# EAGLE design VIC-20_CHARSET_adapter (EAGLE 9.6.2)
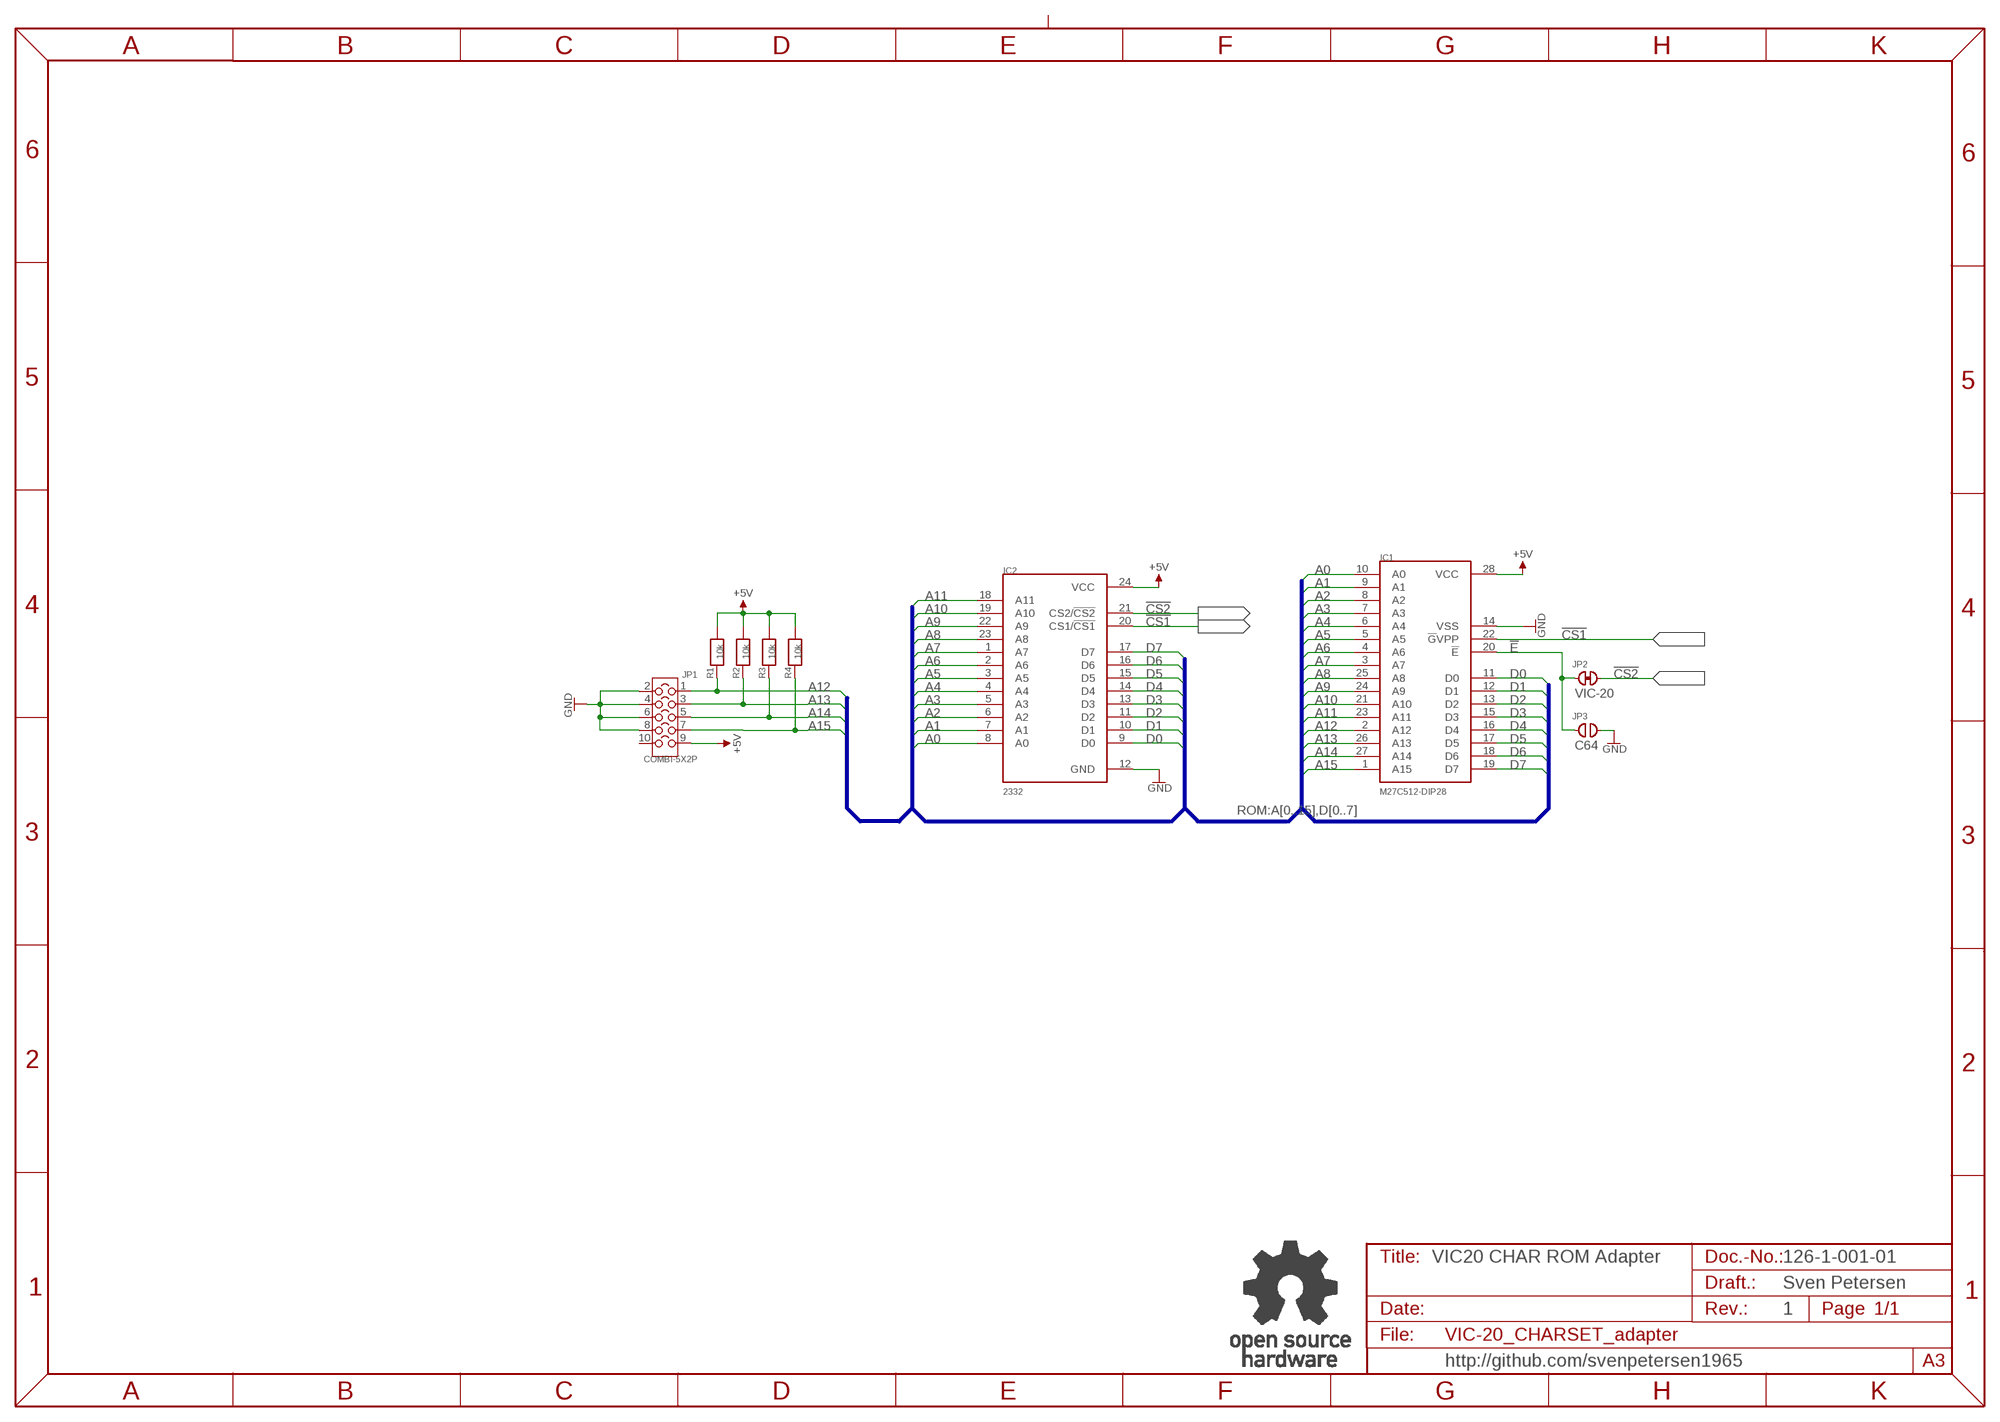
[diagram p0: schematic, sheet 1]

## Parts
IC1  M27C512-DIP28  [DIL28-6]
IC2  2332  [DIL24_SOCKET]
JP1  COMBI-5X2P  [COMBI-5X2]
JP2  CLOSED  [CP_CL]
JP3  OPEN  [CP_OP]
R1  10k  R-0805  [0805]
R2  10k  R-0805  [0805]
R3  10k  R-0805  [0805]
R4  10k  R-0805  [0805]
U$6  OPEN_SOURCE_HW  [OPENHW]

## Nets
!CS1: IC1.22(!G!VPP) IC2.20(CS1/!CS1)
!CS2: IC2.21(CS2/!CS2) JP2.2
!E: IC1.20(!E) JP2.1 JP3.1
+5V: IC1.28(VCC) IC2.24(VCC) JP1.9 R1.2 R2.2 R3.2 R4.2
A0: IC1.10(A0) IC2.8(A0)
A1: IC1.9(A1) IC2.7(A1)
A2: IC1.8(A2) IC2.6(A2)
A3: IC1.7(A3) IC2.5(A3)
A4: IC1.6(A4) IC2.4(A4)
A5: IC1.5(A5) IC2.3(A5)
A6: IC1.4(A6) IC2.2(A6)
A7: IC1.3(A7) IC2.1(A7)
A8: IC1.25(A8) IC2.23(A8)
A9: IC1.24(A9) IC2.22(A9)
A10: IC1.21(A10) IC2.19(A10)
A11: IC1.23(A11) IC2.18(A11)
A12: IC1.2(A12) JP1.1 R1.1
A13: IC1.26(A13) JP1.3 R2.1
A14: IC1.27(A14) JP1.5 R3.1
A15: IC1.1(A15) JP1.7 R4.1
D0: IC1.11(D0) IC2.9(D0)
D1: IC1.12(D1) IC2.10(D1)
D2: IC1.13(D2) IC2.11(D2)
D3: IC1.15(D3) IC2.13(D3)
D4: IC1.16(D4) IC2.14(D4)
D5: IC1.17(D5) IC2.15(D5)
D6: IC1.18(D6) IC2.16(D6)
D7: IC1.19(D7) IC2.17(D7)
GND: IC1.14(VSS) IC2.12(GND) JP1.2 JP1.4 JP1.6 JP1.8 JP3.2
Unconnected: JP1.10

## Buses
ROM:A[0..15],D[0..7]

## Notes on the sheet
- VIC-20
- C64
- VIC20 CHAR ROM Adapter | 126-1-001-01
- Sven Petersen
- 1
- http://github.com/svenpetersen1965

## Library data of the parts
IC1 = ST:M27C512
IC2 = MOS:2332
JP1 = Cutpad:COMBI-5X2P
JP2 = Cutpad:CLOSED: Closed Cutpad
JP3 = Cutpad:OPEN: open Cutpad
R1-R4 = SMD:R-0805
U$6 = Logo:OPEN_SOURCE_HW

## Board
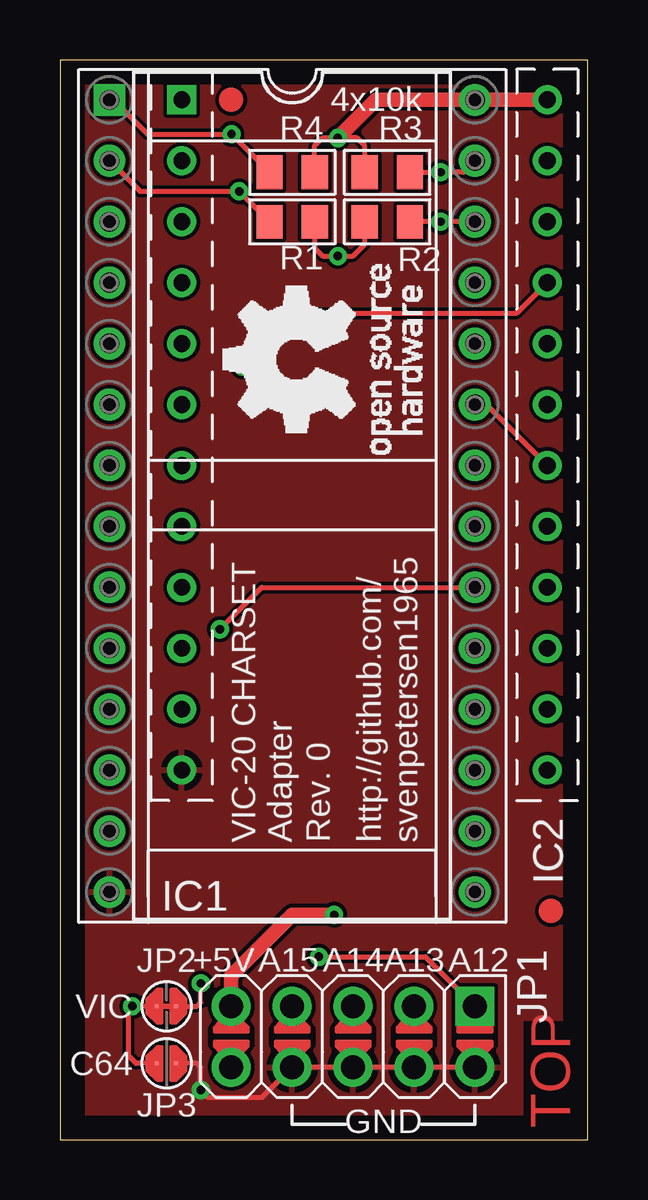
[diagram p1: board, top side]
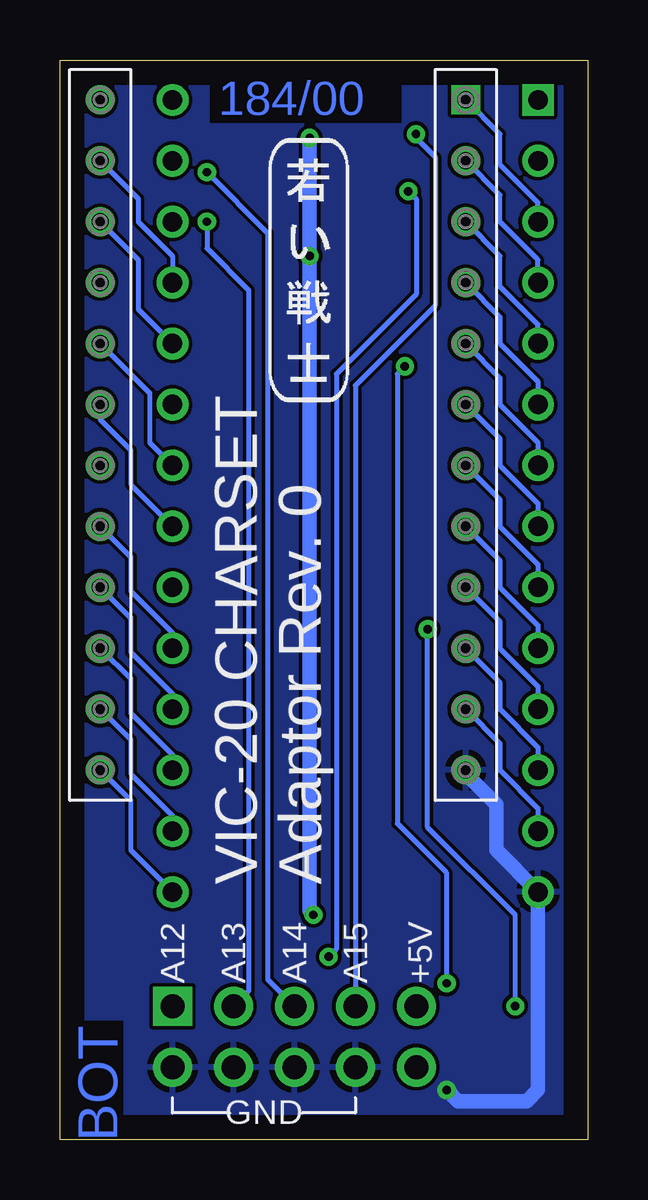
[diagram p2: board, bottom side, seen from below]

Size 22 x 45 mm. Coordinates in mm from the lower left corner, seen from the top.
Outline: 0,0 22,0 22,45 0,45 0,0
Copper layers (1*16): Top 0.035mm / dielectric 1.5mm / Bottom 0.035mm
Design rules "default *": minimum track width 6mil, minimum drill 0.35mm, track to track 6mil, track to pad 6mil, pad to pad 6mil, via to via 6mil, smd to smd 6mil, copper to edge 40mil, drill to drill 6mil, minimum pad ring 10mil, minimum via ring 8mil, stop-mask expansion 4mil, vias tented up to drill 24mil, thermal gap 10mil
bRestrict: 3 lines

### Footprints (pad centres in the part's own frame; a part is rotated, then mirrored left to right if it is on the bottom)
DIL28-6 = drill 0.813 square: 1 -16.51,-7.62 | drill 0.813: 2 -13.97,-7.62; 3 -11.43,-7.62; 4 -8.89,-7.62; 5 -6.35,-7.62; 6 -3.81,-7.62; 7 -1.27,-7.62; 8 1.27,-7.62; 9 3.81,-7.62; 10 6.35,-7.62; 11 8.89,-7.62; 12 11.43,-7.62; 13 13.97,-7.62; 14 16.51,-7.62; 15 16.51,7.62; 16 13.97,7.62; 17 11.43,7.62; 18 8.89,7.62; 19 6.35,7.62; 20 3.81,7.62; 21 1.27,7.62; 22 -1.27,7.62; 23 -3.81,7.62; 24 -6.35,7.62; 25 -8.89,7.62; 26 -11.43,7.62; 27 -13.97,7.62; 28 -16.51,7.62
DIL24_SOCKET = drill 0.7 square: 1 -13.97,-7.62 | drill 0.7: 2 -11.43,-7.62; 3 -8.89,-7.62; 4 -6.35,-7.62; 5 -3.81,-7.62; 6 -1.27,-7.62; 7 1.27,-7.62; 8 3.81,-7.62; 9 6.35,-7.62; 10 8.89,-7.62; 11 11.43,-7.62; 12 13.97,-7.62; 13 13.97,7.62; 14 11.43,7.62; 15 8.89,7.62; 16 6.35,7.62; 17 3.81,7.62; 18 1.27,7.62; 19 -1.27,7.62; 20 -3.81,7.62; 21 -6.35,7.62; 22 -8.89,7.62; 23 -11.43,7.62; 24 -13.97,7.62
COMBI-5X2 = drill 1 pad 1.626 square: 1 -1.27,5.08 | drill 1 pad 1.626: 2 1.27,5.08; 3 -1.27,2.54; 4 1.27,2.54; 5 -1.27,0; 6 1.27,0; 7 -1.27,-2.54; 8 1.27,-2.54; 9 -1.27,-5.08; 10 1.27,-5.08
CP_CL = smd 0.152 x 0.152: 1 -0.4,0; 2 0.4,0
CP_OP = smd 0.152 x 0.152: 1 -0.4,0; 2 0.4,0
0805 = smd 1.092 x 1.397: 1 -0.94,0; 2 0.94,0

### Placement (x,y rotation side)
IC1  9.68,26.83 270 top
IC2  12.7,29.37 270 top
JP1  12.22,4.29 270 top
JP2  4.45,5.56 0 top
JP3  4.45,3.17 0 top
R1  9.68,38.26 0 top
R2  13.65,38.26 180 top
R3  13.65,40.32 180 top
R4  9.68,40.32 0 top
U$6  15.08,28.57 90 top
U$11  [SVEN_TAG]  11.59,36.35 0 bottom
U$16  [GS28P]  9.68,26.83 270 top
U$17  [SMD_REF_R1MM]  7.14,43.34 0 top
U$18  [SMD_REF_R1MM]  20.48,9.53 0 top
U$19  [2LAYER]  21.27,0.48 90 top
U$20  [PCB-TITLE/]  0,58.58 0 top  (outside the outline)

### Tracks (layer width: path | path; a pad name or v marks a point on that pad's centre or on a via)
!CS1
  Bottom 0.203: IC2.20 18.26,31.11 18.26,29.05 IC1.22
!CS2  (via drill 0.35)
  Top 0.203: JP2.2 5.71,5.56 5.87,5.71 v5.87,6.51 | v7.62,32.23 9.84,34.45 19.05,34.45 IC2.21
  Bottom 0.203: v7.62,32.23 7.94,31.91 7.94,13.18 5.87,11.11 v5.87,6.51
!E  (via drill 0.35)
  Top 0.203: JP3.1 3.17,3.17 2.86,3.49 2.86,5.4 v3.02,5.56 JP2.1 | v6.67,21.27 8.41,23.02 IC1.20
  Bottom 0.203: v3.02,5.56 3.02,9.37 6.67,13.02 v6.67,21.27
+5V  (via drill 0.35)
  Top 0.203: R4.2 10.62,41.42 10.95,41.75 v11.59,41.75 12.38,41.75 12.71,41.42 R3.2 | R1.2 10.62,37.16 10.95,36.83 v11.59,36.83 12.22,36.83 12.71,37.32 R2.2
  Top 0.61: IC2.24 IC1.28 13.18,43.34 v11.59,41.75 | v11.43,9.37 9.68,9.37 7.14,6.83 JP1.9
  Bottom 0.61: v11.43,9.37 11.59,9.53 v11.59,36.83 v11.59,41.75
A0
  Bottom 0.203: IC2.8 3.65,24.13 3.65,23.02 2.06,21.43 IC1.10
A1
  Bottom 0.203: IC2.7 3.65,26.67 3.65,25.56 2.06,23.97 IC1.9
A2
  Bottom 0.203: IC2.6 3.65,29.21 3.65,28.1 2.06,26.51 IC1.8
A3
  Bottom 0.203: IC2.5 3.65,31.75 3.65,30.64 2.06,29.05 IC1.7
A4
  Bottom 0.203: IC2.4 3.65,34.29 3.65,33.18 2.06,31.59 IC1.6
A5
  Bottom 0.203: IC1.5 2.06,33.97 3.65,35.56 3.65,36.83 IC2.3
A6
  Bottom 0.203: IC1.4 2.06,36.67 3.65,38.26 3.65,39.37 IC2.2
A7
  Bottom 0.203: IC1.3 2.06,39.05 3.65,40.64 3.65,41.91 IC2.1
A8
  Bottom 0.203: IC2.23 18.73,39.21 18.73,38.26 17.3,36.83 IC1.25
A9
  Bottom 0.203: IC2.22 18.73,36.67 18.73,34.61 IC1.24
A10
  Bottom 0.203: IC2.19 20.32,30 19.05,28.73 19.05,27.3 IC1.21
A11
  Top 0.203: IC1.23 17.78,30.64 IC2.18
A12  (via drill 0.35)
  Top 0.203: IC1.2 3.33,39.53 v7.47,39.53 R1.1 | v10.79,7.62 15.24,7.62 JP1.1
  Bottom 0.203: v7.47,39.53 7.14,39.2 7.14,35.24 10.48,31.91 10.48,7.94 v10.79,7.62
A13  (via drill 0.35)
  Top 0.203: IC1.26 v15.88,38.26 R2.1
  Bottom 0.203: v15.88,38.26 15.88,37.15 14.13,35.4 14.13,6.19 JP1.3
A14  (via drill 0.35)
  Top 0.203: IC1.27 16.83,40.32 v15.88,40.32 R3.1
  Bottom 0.203: v15.88,40.32 13.34,37.78 13.34,6.67 JP1.5
A15  (via drill 0.35)
  Top 0.203: IC1.1 2.22,43.34 3.65,41.91 v7.16,41.91 R4.1
  Bottom 0.203: v7.16,41.91 7.16,41.76 6.35,40.96 6.35,34.77 9.68,31.43 JP1.7
D0
  Bottom 0.203: IC2.9 3.65,21.59 3.65,20.48 2.06,18.89 IC1.11
D1
  Bottom 0.203: IC2.10 3.65,19.05 3.65,17.94 2.06,16.35 IC1.12
D2
  Bottom 0.203: IC2.11 3.65,16.51 3.65,15.4 2.06,13.81 IC1.13
D3
  Bottom 0.203: IC2.13 19.05,14.13 19.05,12.06 IC1.15
D4
  Bottom 0.203: IC2.14 19.05,16.67 19.05,15.24 17.3,13.49 IC1.16
D5
  Bottom 0.203: IC2.15 19.05,19.21 19.05,17.78 17.3,16.03 IC1.17
D6
  Bottom 0.203: IC2.16 19.05,21.75 19.05,20.32 17.3,18.57 IC1.18
D7
  Bottom 0.203: IC2.17 19.05,24.29 19.05,22.86 17.3,21.11 IC1.19
GND  (via drill 0.35)
  Top 0.203: JP1.2 JP1.4 JP1.6 JP1.8 8.41,1.75 6.19,1.75 v5.87,2.06 5.87,3.02 5.71,3.17 JP3.2
  Bottom 0.61: IC2.12 5.08,15.24 3.81,13.97 3.81,12.06 IC1.14 2.06,2.06 2.54,1.59 5.4,1.59 v5.87,2.06
  pour Top: 0.64,0.64 21.27,0.64 21.27,44.13 0.64,44.13
  pour Bottom: 0.64,0.64 21.27,0.64 21.27,44.13 0.64,44.13

### Text on the board
Bottom: 184/00
tPlace: 4x10k | VIC-20 CHARSET / Adapter | Rev. 0 | http://github.com/ / svenpetersen1965 | +5V | A15 | A14 | A13 | A12 | VIC | C64 | GND
bPlace: VIC-20 CHARSET / Adaptor Rev. 0 | +5V | A15 | A14 | A13 | A12 | GND
Document: Sven Petersen | 184-2-01-00 | 2021 | 35µm | 2 | 0